# Altium project Project Board Module AM625.PrjPCB (part 1 of 2)
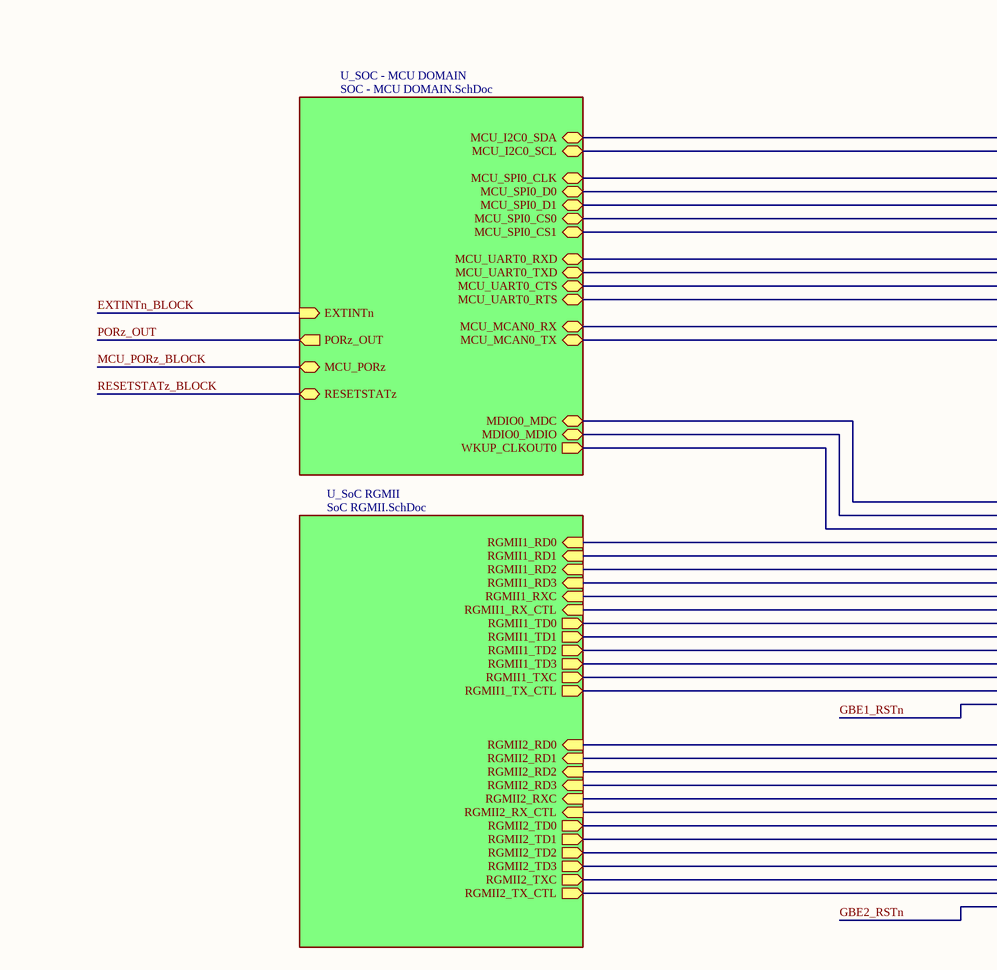
[diagram p0: BLOCK DIAGRAM.SchDoc, top left]
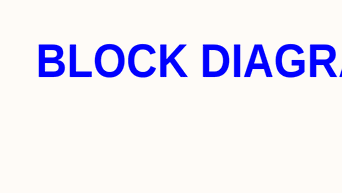
[diagram p1: BLOCK DIAGRAM.SchDoc, top right]
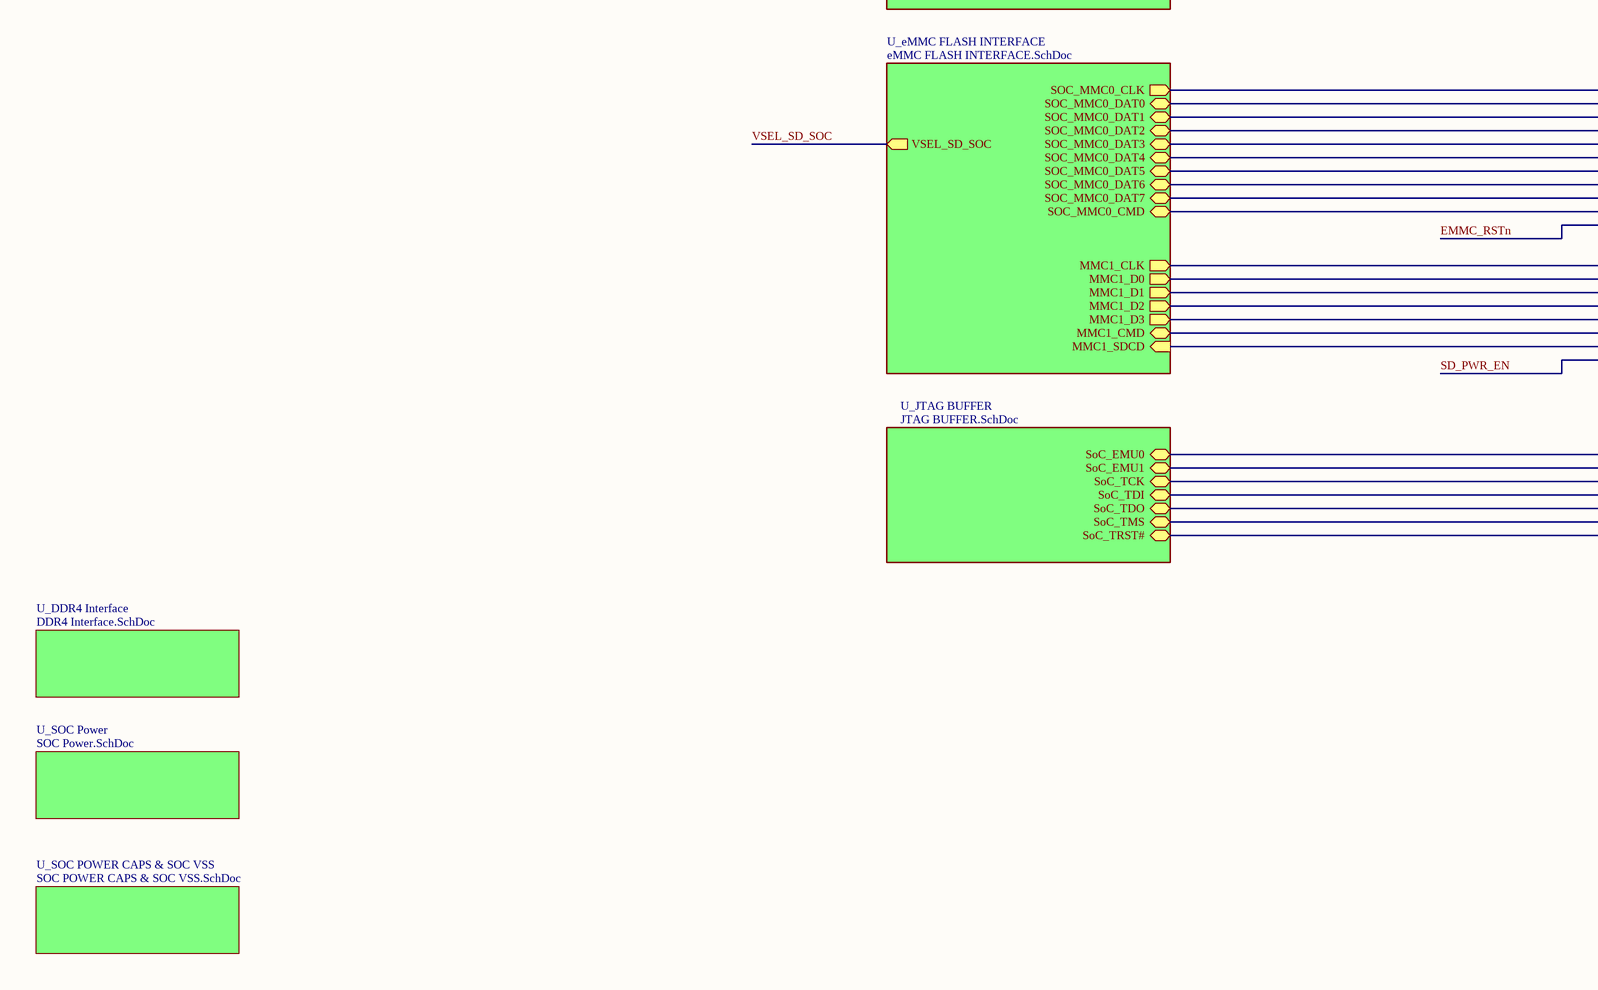
[diagram p2: BLOCK DIAGRAM.SchDoc, bottom left]
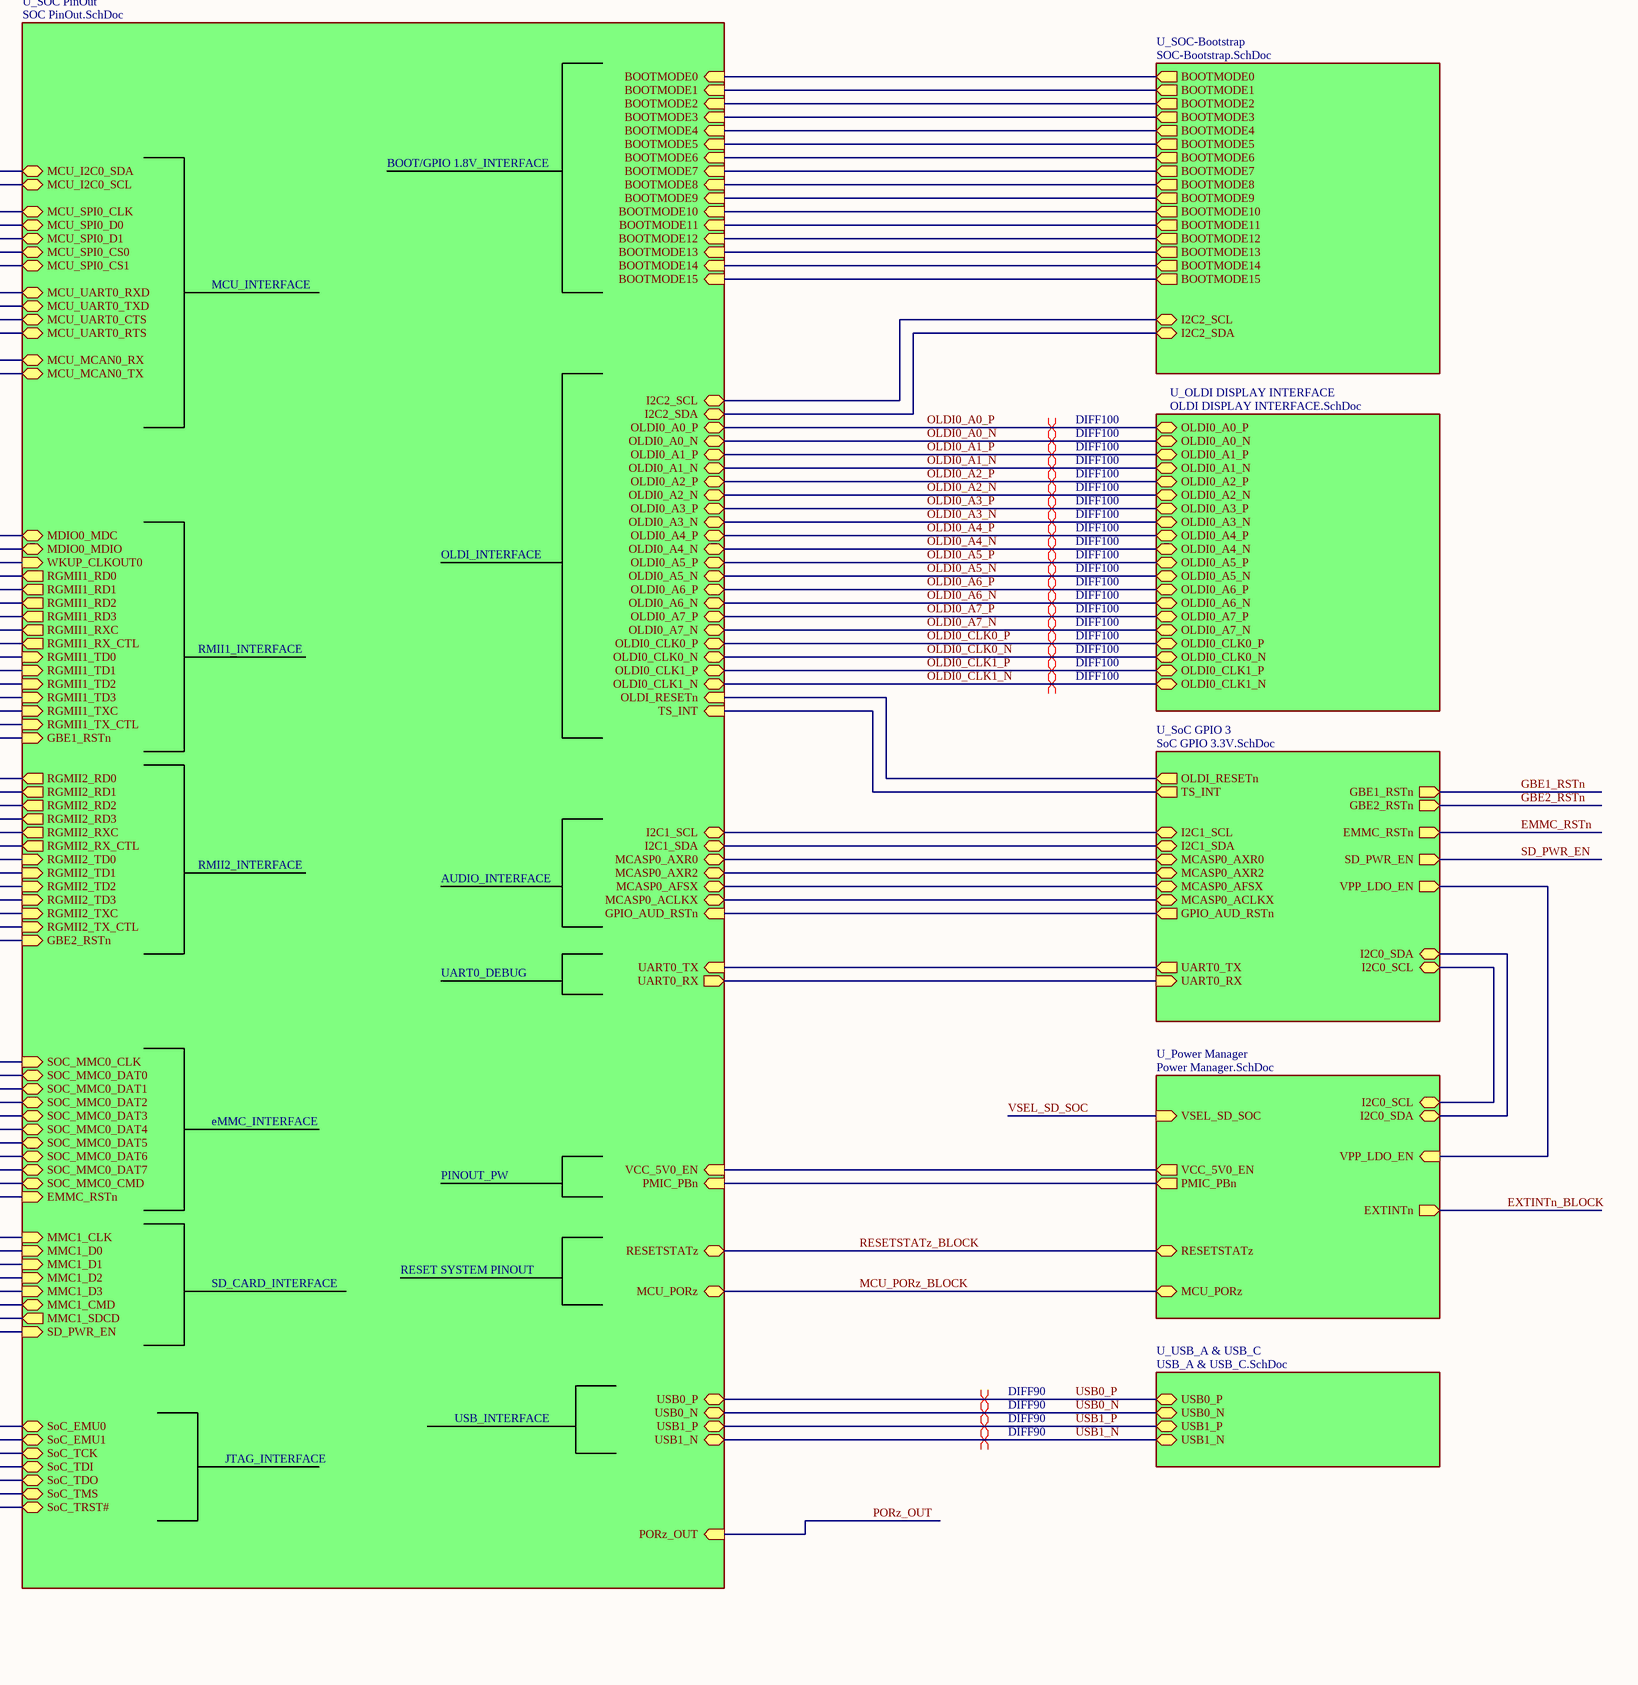
[diagram p3: BLOCK DIAGRAM.SchDoc, bottom right]
8 sheets, 155 parts. Net scope: flat (ports and power ports of the same name join across sheets).
Board file: PCB MODULE AM625.PcbDoc
Sheets:
  BLOCK DIAGRAM.SchDoc
    U_Power Manager = Power Manager.SchDoc
    U_SOC-Bootstrap = SOC-Bootstrap.SchDoc
    U_eMMC FLASH INTERFACE = eMMC FLASH INTERFACE.SchDoc
    U_DDR4 Interface = DDR4 Interface.SchDoc
    U_SOC POWER CAPS & SOC VSS = SOC POWER CAPS & SOC VSS.SchDoc
    U_SoC GPIO 3 = SoC GPIO 3.3V.SchDoc
    U_USB_A & USB_C = USB_A & USB_C.SchDoc

## Sheet BLOCK DIAGRAM.SchDoc
size A1; DocumentNumber: 14; SheetNumber: 1; SheetTotal: 14

### Sub-sheets
U_DDR4 Interface = DDR4 Interface.SchDoc: no entries
U_eMMC FLASH INTERFACE = eMMC FLASH INTERFACE.SchDoc: SOC_MMC0_CLK (out), SOC_MMC0_DAT0 (bidir), SOC_MMC0_DAT1 (bidir), SOC_MMC0_DAT2 (bidir), SOC_MMC0_DAT3 (bidir), SOC_MMC0_DAT4 (bidir), SOC_MMC0_DAT5 (bidir), SOC_MMC0_DAT6 (bidir), SOC_MMC0_DAT7 (bidir), SOC_MMC0_CMD (bidir), VSEL_SD_SOC (out), MMC1_CMD (bidir), MMC1_D1 (out), MMC1_D0 (out), MMC1_SDCD (in), MMC1_D3 (out), MMC1_CLK (out), MMC1_D2 (out)
U_JTAG BUFFER = JTAG BUFFER.SchDoc (file not in this document): SoC_EMU0 (bidir), SoC_EMU1 (bidir), SoC_TCK (bidir), SoC_TDI (bidir), SoC_TDO (bidir), SoC_TMS (bidir), SoC_TRST# (bidir)
U_OLDI DISPLAY INTERFACE = OLDI DISPLAY INTERFACE.SchDoc (file not in this document): OLDI0_A0_P (bidir), OLDI0_A0_N (bidir), OLDI0_A1_P (bidir), OLDI0_A1_N (bidir), OLDI0_A2_P (bidir), OLDI0_A2_N (bidir), OLDI0_A3_P (bidir), OLDI0_A3_N (bidir), OLDI0_A4_P (bidir), OLDI0_A4_N (bidir), OLDI0_A5_P (bidir), OLDI0_A5_N (bidir), OLDI0_A6_P (bidir), OLDI0_A6_N (bidir), OLDI0_A7_P (bidir), OLDI0_A7_N (bidir), OLDI0_CLK0_P (bidir), OLDI0_CLK0_N (bidir), OLDI0_CLK1_P (bidir), OLDI0_CLK1_N (bidir)
U_Power Manager = Power Manager.SchDoc: VCC_5V0_EN (out), VSEL_SD_SOC (in), RESETSTATz (bidir), VPP_LDO_EN (in), MCU_PORz (bidir), EXTINTn (out), I2C0_SDA (bidir), I2C0_SCL (bidir), PMIC_PBn (out)
U_SOC - MCU DOMAIN = SOC - MCU DOMAIN.SchDoc (file not in this document): MDIO0_MDC (bidir), MDIO0_MDIO (bidir), WKUP_CLKOUT0 (out), MCU_I2C0_SCL (bidir), MCU_I2C0_SDA (bidir), MCU_SPI0_CLK (bidir), MCU_SPI0_D0 (bidir), MCU_SPI0_D1 (bidir), MCU_SPI0_CS0 (bidir), MCU_SPI0_CS1 (bidir), MCU_UART0_RXD (bidir), MCU_UART0_TXD (bidir), MCU_UART0_CTS (bidir), MCU_UART0_RTS (bidir), MCU_MCAN0_RX (bidir), MCU_MCAN0_TX (bidir), MCU_PORz (bidir), EXTINTn (in), PORz_OUT (out), RESETSTATz (bidir)
U_SoC GPIO 3 = SoC GPIO 3.3V.SchDoc: OLDI_RESETn (out), I2C0_SDA (bidir), I2C0_SCL (bidir), I2C1_SDA (bidir), I2C1_SCL (bidir), EMMC_RSTn (out), VPP_LDO_EN (out), MCASP0_ACLKX (bidir), MCASP0_AXR2 (bidir), MCASP0_AXR0 (bidir), MCASP0_AFSX (bidir), GPIO_AUD_RSTn (out), TS_INT (out), UART0_RX (in), UART0_TX (out), SD_PWR_EN (out), GBE2_RSTn (out), GBE1_RSTn (out)
U_SOC PinOut = SOC PinOut.SchDoc (file not in this document): VCC_5V0_EN (in), SOC_MMC0_CLK (in), SOC_MMC0_DAT0 (bidir), SOC_MMC0_DAT1 (bidir), SOC_MMC0_DAT2 (bidir), SOC_MMC0_DAT3 (bidir), SOC_MMC0_DAT4 (bidir), SOC_MMC0_DAT5 (bidir), SOC_MMC0_DAT6 (bidir), SOC_MMC0_DAT7 (bidir), SOC_MMC0_CMD (bidir), EMMC_RSTn (in), SoC_EMU0 (bidir), SoC_EMU1 (bidir), SoC_TCK (bidir), SoC_TDO (bidir), SoC_TRST# (bidir), MCU_I2C0_SCL (bidir), MCU_I2C0_SDA (bidir), MCU_SPI0_CLK (bidir), MCU_SPI0_D0 (bidir), MCU_SPI0_D1 (bidir), MCU_SPI0_CS0 (bidir), MCU_SPI0_CS1 (bidir), MCU_UART0_RXD (bidir), MCU_UART0_TXD (bidir), MCU_UART0_CTS (bidir), MCU_UART0_RTS (bidir), MCU_MCAN0_RX (bidir), MCU_MCAN0_TX (bidir), OLDI0_A0_P (bidir), OLDI0_A0_N (bidir), OLDI0_A1_P (bidir), OLDI0_A1_N (bidir), OLDI0_A2_P (bidir), OLDI0_A2_N (bidir), OLDI0_A3_P (bidir), OLDI0_A3_N (bidir), OLDI0_A4_P (bidir), OLDI0_A4_N (bidir), OLDI0_A5_P (bidir), OLDI0_A5_N (bidir), OLDI0_A6_P (bidir), OLDI0_A6_N (bidir), OLDI0_A7_P (bidir), OLDI0_A7_N (bidir), OLDI0_CLK0_P (bidir), OLDI0_CLK0_N (bidir), OLDI0_CLK1_P (bidir), OLDI0_CLK1_N (bidir), I2C2_SCL (bidir), I2C2_SDA (bidir), RGMII1_RD0 (out), RGMII1_RD1 (out), RGMII1_RD2 (out), RGMII1_RD3 (out), RGMII1_RXC (out), RGMII1_RX_CTL (out), RGMII1_TD0 (in), RGMII1_TXC (in), RGMII1_TX_CTL (in), RGMII1_TD1 (in), RGMII1_TD2 (in), RGMII1_TD3 (in), MDIO0_MDC (bidir), MDIO0_MDIO (bidir), WKUP_CLKOUT0 (in), BOOTMODE0 (in), BOOTMODE1 (in), BOOTMODE2 (in), BOOTMODE3 (in), BOOTMODE4 (in), BOOTMODE5 (in), BOOTMODE6 (in), BOOTMODE7 (in), BOOTMODE8 (in), BOOTMODE9 (in), BOOTMODE10 (in), BOOTMODE11 (in), BOOTMODE12 (in), BOOTMODE13 (in), BOOTMODE14 (in), BOOTMODE15 (in), PORz_OUT (in), RESETSTATz (bidir), USB0_P (bidir), USB0_N (bidir), I2C1_SDA (bidir), I2C1_SCL (bidir), MCASP0_ACLKX (bidir), MCASP0_AXR2 (bidir), MCASP0_AXR0 (bidir), MCASP0_AFSX (bidir), GPIO_AUD_RSTn (in), USB1_P (bidir), USB1_N (bidir), OLDI_RESETn (in), TS_INT (in), UART0_RX (out), UART0_TX (in), RGMII2_TD0 (in), MMC1_CLK (in), RGMII2_RD3 (out), MMC1_D3 (in), MMC1_CMD (bidir), RGMII2_RD0 (out), MMC1_D1 (in), RGMII2_RX_CTL (out), RGMII2_TXC (in), SD_PWR_EN (in), MMC1_D2 (in), MMC1_SDCD (out), RGMII2_RXC (out), RGMII2_RD2 (out), GBE2_RSTn (in), RGMII2_TD2 (in), RGMII2_TD1 (in), RGMII2_TX_CTL (in), MCU_PORz (bidir), RGMII2_TD3 (in), MMC1_D0 (in), RGMII2_RD1 (out), GBE1_RSTn (in), SoC_TDI (bidir), SoC_TMS (bidir), PMIC_PBn (in)
U_SOC Power = SOC Power.SchDoc (file not in this document): no entries
U_SOC POWER CAPS & SOC VSS = SOC POWER CAPS & SOC VSS.SchDoc: no entries
U_SoC RGMII = SoC RGMII.SchDoc (file not in this document): RGMII1_RD0 (in), RGMII1_RD1 (in), RGMII1_RD2 (in), RGMII1_RD3 (in), RGMII1_RXC (in), RGMII1_RX_CTL (in), RGMII1_TD0 (out), RGMII1_TXC (out), RGMII1_TX_CTL (out), RGMII1_TD1 (out), RGMII1_TD2 (out), RGMII1_TD3 (out), RGMII2_RD1 (in), RGMII2_RD0 (in), RGMII2_RXC (in), RGMII2_RD2 (in), RGMII2_TX_CTL (out), RGMII2_TD2 (out), RGMII2_RX_CTL (in), RGMII2_TD1 (out), RGMII2_TD0 (out), RGMII2_TXC (out), RGMII2_TD3 (out), RGMII2_RD3 (in)
U_SOC-Bootstrap = SOC-Bootstrap.SchDoc: BOOTMODE0 (out), BOOTMODE1 (out), BOOTMODE2 (out), BOOTMODE3 (out), BOOTMODE4 (out), BOOTMODE5 (out), BOOTMODE6 (out), BOOTMODE7 (out), BOOTMODE8 (out), BOOTMODE9 (out), BOOTMODE10 (out), BOOTMODE11 (out), BOOTMODE12 (out), BOOTMODE13 (out), BOOTMODE14 (out), BOOTMODE15 (out), I2C2_SCL (bidir), I2C2_SDA (bidir)
U_USB_A & USB_C = USB_A & USB_C.SchDoc: USB0_P (bidir), USB0_N (bidir), USB1_P (bidir), USB1_N (bidir)

### Nets
EMMC_RSTn: sheet U_SOC PinOut/EMMC_RSTn, sheet U_SoC GPIO 3/EMMC_RSTn
EXTINTn_BLOCK: sheet U_Power Manager/EXTINTn, sheet U_SOC - MCU DOMAIN/EXTINTn
GBE1_RSTn: sheet U_SOC PinOut/GBE1_RSTn, sheet U_SoC GPIO 3/GBE1_RSTn
GBE2_RSTn: sheet U_SOC PinOut/GBE2_RSTn, sheet U_SoC GPIO 3/GBE2_RSTn
MCU_PORz_BLOCK: sheet U_Power Manager/MCU_PORz, sheet U_SOC - MCU DOMAIN/MCU_PORz, sheet U_SOC PinOut/MCU_PORz
OLDI0_A0_N: sheet U_SOC PinOut/OLDI0_A0_N, sheet U_OLDI DISPLAY INTERFACE/OLDI0_A0_N
OLDI0_A0_P: sheet U_SOC PinOut/OLDI0_A0_P, sheet U_OLDI DISPLAY INTERFACE/OLDI0_A0_P
OLDI0_A1_N: sheet U_SOC PinOut/OLDI0_A1_N, sheet U_OLDI DISPLAY INTERFACE/OLDI0_A1_N
OLDI0_A1_P: sheet U_SOC PinOut/OLDI0_A1_P, sheet U_OLDI DISPLAY INTERFACE/OLDI0_A1_P
OLDI0_A2_N: sheet U_SOC PinOut/OLDI0_A2_N, sheet U_OLDI DISPLAY INTERFACE/OLDI0_A2_N
OLDI0_A2_P: sheet U_SOC PinOut/OLDI0_A2_P, sheet U_OLDI DISPLAY INTERFACE/OLDI0_A2_P
OLDI0_A3_N: sheet U_SOC PinOut/OLDI0_A3_N, sheet U_OLDI DISPLAY INTERFACE/OLDI0_A3_N
OLDI0_A3_P: sheet U_SOC PinOut/OLDI0_A3_P, sheet U_OLDI DISPLAY INTERFACE/OLDI0_A3_P
OLDI0_A4_N: sheet U_SOC PinOut/OLDI0_A4_N, sheet U_OLDI DISPLAY INTERFACE/OLDI0_A4_N
OLDI0_A4_P: sheet U_SOC PinOut/OLDI0_A4_P, sheet U_OLDI DISPLAY INTERFACE/OLDI0_A4_P
OLDI0_A5_N: sheet U_SOC PinOut/OLDI0_A5_N, sheet U_OLDI DISPLAY INTERFACE/OLDI0_A5_N
OLDI0_A5_P: sheet U_SOC PinOut/OLDI0_A5_P, sheet U_OLDI DISPLAY INTERFACE/OLDI0_A5_P
OLDI0_A6_N: sheet U_SOC PinOut/OLDI0_A6_N, sheet U_OLDI DISPLAY INTERFACE/OLDI0_A6_N
OLDI0_A6_P: sheet U_SOC PinOut/OLDI0_A6_P, sheet U_OLDI DISPLAY INTERFACE/OLDI0_A6_P
OLDI0_A7_N: sheet U_SOC PinOut/OLDI0_A7_N, sheet U_OLDI DISPLAY INTERFACE/OLDI0_A7_N
OLDI0_A7_P: sheet U_SOC PinOut/OLDI0_A7_P, sheet U_OLDI DISPLAY INTERFACE/OLDI0_A7_P
OLDI0_CLK0_N: sheet U_SOC PinOut/OLDI0_CLK0_N, sheet U_OLDI DISPLAY INTERFACE/OLDI0_CLK0_N
OLDI0_CLK0_P: sheet U_SOC PinOut/OLDI0_CLK0_P, sheet U_OLDI DISPLAY INTERFACE/OLDI0_CLK0_P
OLDI0_CLK1_N: sheet U_SOC PinOut/OLDI0_CLK1_N, sheet U_OLDI DISPLAY INTERFACE/OLDI0_CLK1_N
OLDI0_CLK1_P: sheet U_SOC PinOut/OLDI0_CLK1_P, sheet U_OLDI DISPLAY INTERFACE/OLDI0_CLK1_P
PORz_OUT: sheet U_SOC - MCU DOMAIN/PORz_OUT, sheet U_SOC PinOut/PORz_OUT
RESETSTATz_BLOCK: sheet U_Power Manager/RESETSTATz, sheet U_SOC - MCU DOMAIN/RESETSTATz, sheet U_SOC PinOut/RESETSTATz
SD_PWR_EN: sheet U_SOC PinOut/SD_PWR_EN, sheet U_SoC GPIO 3/SD_PWR_EN
USB0_N: sheet U_SOC PinOut/USB0_N, sheet U_USB_A & USB_C/USB0_N
USB0_P: sheet U_SOC PinOut/USB0_P, sheet U_USB_A & USB_C/USB0_P
USB1_N: sheet U_SOC PinOut/USB1_N, sheet U_USB_A & USB_C/USB1_N
USB1_P: sheet U_SOC PinOut/USB1_P, sheet U_USB_A & USB_C/USB1_P
VSEL_SD_SOC: sheet U_Power Manager/VSEL_SD_SOC, sheet U_eMMC FLASH INTERFACE/VSEL_SD_SOC
(unnamed): sheet U_Power Manager/VCC_5V0_EN, sheet U_SOC PinOut/VCC_5V0_EN
(unnamed): sheet U_Power Manager/VPP_LDO_EN, sheet U_SoC GPIO 3/VPP_LDO_EN
(unnamed): sheet U_Power Manager/I2C0_SDA, sheet U_SoC GPIO 3/I2C0_SDA
(unnamed): sheet U_Power Manager/I2C0_SCL, sheet U_SoC GPIO 3/I2C0_SCL
(unnamed): sheet U_Power Manager/PMIC_PBn, sheet U_SOC PinOut/PMIC_PBn
(unnamed): sheet U_SOC - MCU DOMAIN/MDIO0_MDC, sheet U_SOC PinOut/MDIO0_MDC
(unnamed): sheet U_SOC - MCU DOMAIN/MDIO0_MDIO, sheet U_SOC PinOut/MDIO0_MDIO
(unnamed): sheet U_SOC - MCU DOMAIN/WKUP_CLKOUT0, sheet U_SOC PinOut/WKUP_CLKOUT0
(unnamed): sheet U_SOC - MCU DOMAIN/MCU_I2C0_SCL, sheet U_SOC PinOut/MCU_I2C0_SCL
(unnamed): sheet U_SOC - MCU DOMAIN/MCU_I2C0_SDA, sheet U_SOC PinOut/MCU_I2C0_SDA
(unnamed): sheet U_SOC - MCU DOMAIN/MCU_SPI0_CLK, sheet U_SOC PinOut/MCU_SPI0_CLK
(unnamed): sheet U_SOC - MCU DOMAIN/MCU_SPI0_D0, sheet U_SOC PinOut/MCU_SPI0_D0
(unnamed): sheet U_SOC - MCU DOMAIN/MCU_SPI0_D1, sheet U_SOC PinOut/MCU_SPI0_D1
(unnamed): sheet U_SOC - MCU DOMAIN/MCU_SPI0_CS0, sheet U_SOC PinOut/MCU_SPI0_CS0
(unnamed): sheet U_SOC - MCU DOMAIN/MCU_SPI0_CS1, sheet U_SOC PinOut/MCU_SPI0_CS1
(unnamed): sheet U_SOC - MCU DOMAIN/MCU_UART0_RXD, sheet U_SOC PinOut/MCU_UART0_RXD
(unnamed): sheet U_SOC - MCU DOMAIN/MCU_UART0_TXD, sheet U_SOC PinOut/MCU_UART0_TXD
(unnamed): sheet U_SOC - MCU DOMAIN/MCU_UART0_CTS, sheet U_SOC PinOut/MCU_UART0_CTS
(unnamed): sheet U_SOC - MCU DOMAIN/MCU_UART0_RTS, sheet U_SOC PinOut/MCU_UART0_RTS
(unnamed): sheet U_SOC - MCU DOMAIN/MCU_MCAN0_RX, sheet U_SOC PinOut/MCU_MCAN0_RX
(unnamed): sheet U_SOC - MCU DOMAIN/MCU_MCAN0_TX, sheet U_SOC PinOut/MCU_MCAN0_TX
(unnamed): sheet U_SOC PinOut/SOC_MMC0_CLK, sheet U_eMMC FLASH INTERFACE/SOC_MMC0_CLK
(unnamed): sheet U_SOC PinOut/SOC_MMC0_DAT0, sheet U_eMMC FLASH INTERFACE/SOC_MMC0_DAT0
(unnamed): sheet U_SOC PinOut/SOC_MMC0_DAT1, sheet U_eMMC FLASH INTERFACE/SOC_MMC0_DAT1
(unnamed): sheet U_SOC PinOut/SOC_MMC0_DAT2, sheet U_eMMC FLASH INTERFACE/SOC_MMC0_DAT2
(unnamed): sheet U_SOC PinOut/SOC_MMC0_DAT3, sheet U_eMMC FLASH INTERFACE/SOC_MMC0_DAT3
(unnamed): sheet U_SOC PinOut/SOC_MMC0_DAT4, sheet U_eMMC FLASH INTERFACE/SOC_MMC0_DAT4
(unnamed): sheet U_SOC PinOut/SOC_MMC0_DAT5, sheet U_eMMC FLASH INTERFACE/SOC_MMC0_DAT5
(unnamed): sheet U_SOC PinOut/SOC_MMC0_DAT6, sheet U_eMMC FLASH INTERFACE/SOC_MMC0_DAT6
(unnamed): sheet U_SOC PinOut/SOC_MMC0_DAT7, sheet U_eMMC FLASH INTERFACE/SOC_MMC0_DAT7
(unnamed): sheet U_SOC PinOut/SOC_MMC0_CMD, sheet U_eMMC FLASH INTERFACE/SOC_MMC0_CMD
(unnamed): sheet U_SOC PinOut/SoC_EMU0, sheet U_JTAG BUFFER/SoC_EMU0
(unnamed): sheet U_SOC PinOut/SoC_EMU1, sheet U_JTAG BUFFER/SoC_EMU1
(unnamed): sheet U_SOC PinOut/SoC_TCK, sheet U_JTAG BUFFER/SoC_TCK
(unnamed): sheet U_SOC PinOut/SoC_TDO, sheet U_JTAG BUFFER/SoC_TDO
(unnamed): sheet U_SOC PinOut/SoC_TRST#, sheet U_JTAG BUFFER/SoC_TRST#
(unnamed): sheet U_SOC PinOut/I2C2_SCL, sheet U_SOC-Bootstrap/I2C2_SCL
(unnamed): sheet U_SOC PinOut/I2C2_SDA, sheet U_SOC-Bootstrap/I2C2_SDA
(unnamed): sheet U_SOC PinOut/RGMII1_RD0, sheet U_SoC RGMII/RGMII1_RD0
(unnamed): sheet U_SOC PinOut/RGMII1_RD1, sheet U_SoC RGMII/RGMII1_RD1
(unnamed): sheet U_SOC PinOut/RGMII1_RD2, sheet U_SoC RGMII/RGMII1_RD2
(unnamed): sheet U_SOC PinOut/RGMII1_RD3, sheet U_SoC RGMII/RGMII1_RD3
(unnamed): sheet U_SOC PinOut/RGMII1_RXC, sheet U_SoC RGMII/RGMII1_RXC
(unnamed): sheet U_SOC PinOut/RGMII1_RX_CTL, sheet U_SoC RGMII/RGMII1_RX_CTL
(unnamed): sheet U_SOC PinOut/RGMII1_TD0, sheet U_SoC RGMII/RGMII1_TD0
(unnamed): sheet U_SOC PinOut/RGMII1_TXC, sheet U_SoC RGMII/RGMII1_TXC
(unnamed): sheet U_SOC PinOut/RGMII1_TX_CTL, sheet U_SoC RGMII/RGMII1_TX_CTL
(unnamed): sheet U_SOC PinOut/RGMII1_TD1, sheet U_SoC RGMII/RGMII1_TD1
(unnamed): sheet U_SOC PinOut/RGMII1_TD2, sheet U_SoC RGMII/RGMII1_TD2
(unnamed): sheet U_SOC PinOut/RGMII1_TD3, sheet U_SoC RGMII/RGMII1_TD3
(unnamed): sheet U_SOC PinOut/BOOTMODE0, sheet U_SOC-Bootstrap/BOOTMODE0
(unnamed): sheet U_SOC PinOut/BOOTMODE1, sheet U_SOC-Bootstrap/BOOTMODE1
(unnamed): sheet U_SOC PinOut/BOOTMODE2, sheet U_SOC-Bootstrap/BOOTMODE2
(unnamed): sheet U_SOC PinOut/BOOTMODE3, sheet U_SOC-Bootstrap/BOOTMODE3
(unnamed): sheet U_SOC PinOut/BOOTMODE4, sheet U_SOC-Bootstrap/BOOTMODE4
(unnamed): sheet U_SOC PinOut/BOOTMODE5, sheet U_SOC-Bootstrap/BOOTMODE5
(unnamed): sheet U_SOC PinOut/BOOTMODE6, sheet U_SOC-Bootstrap/BOOTMODE6
(unnamed): sheet U_SOC PinOut/BOOTMODE7, sheet U_SOC-Bootstrap/BOOTMODE7
(unnamed): sheet U_SOC PinOut/BOOTMODE8, sheet U_SOC-Bootstrap/BOOTMODE8
(unnamed): sheet U_SOC PinOut/BOOTMODE9, sheet U_SOC-Bootstrap/BOOTMODE9
(unnamed): sheet U_SOC PinOut/BOOTMODE10, sheet U_SOC-Bootstrap/BOOTMODE10
(unnamed): sheet U_SOC PinOut/BOOTMODE11, sheet U_SOC-Bootstrap/BOOTMODE11
(unnamed): sheet U_SOC PinOut/BOOTMODE12, sheet U_SOC-Bootstrap/BOOTMODE12
(unnamed): sheet U_SOC PinOut/BOOTMODE13, sheet U_SOC-Bootstrap/BOOTMODE13
(unnamed): sheet U_SOC PinOut/BOOTMODE14, sheet U_SOC-Bootstrap/BOOTMODE14
(unnamed): sheet U_SOC PinOut/BOOTMODE15, sheet U_SOC-Bootstrap/BOOTMODE15
(unnamed): sheet U_SOC PinOut/I2C1_SDA, sheet U_SoC GPIO 3/I2C1_SDA
(unnamed): sheet U_SOC PinOut/I2C1_SCL, sheet U_SoC GPIO 3/I2C1_SCL
(unnamed): sheet U_SOC PinOut/MCASP0_ACLKX, sheet U_SoC GPIO 3/MCASP0_ACLKX
(unnamed): sheet U_SOC PinOut/MCASP0_AXR2, sheet U_SoC GPIO 3/MCASP0_AXR2
(unnamed): sheet U_SOC PinOut/MCASP0_AXR0, sheet U_SoC GPIO 3/MCASP0_AXR0
(unnamed): sheet U_SOC PinOut/MCASP0_AFSX, sheet U_SoC GPIO 3/MCASP0_AFSX
(unnamed): sheet U_SOC PinOut/GPIO_AUD_RSTn, sheet U_SoC GPIO 3/GPIO_AUD_RSTn
(unnamed): sheet U_SOC PinOut/OLDI_RESETn, sheet U_SoC GPIO 3/OLDI_RESETn
(unnamed): sheet U_SOC PinOut/TS_INT, sheet U_SoC GPIO 3/TS_INT
(unnamed): sheet U_SOC PinOut/UART0_RX, sheet U_SoC GPIO 3/UART0_RX
(unnamed): sheet U_SOC PinOut/UART0_TX, sheet U_SoC GPIO 3/UART0_TX
(unnamed): sheet U_SOC PinOut/RGMII2_TD0, sheet U_SoC RGMII/RGMII2_TD0
(unnamed): sheet U_SOC PinOut/MMC1_CLK, sheet U_eMMC FLASH INTERFACE/MMC1_CLK
(unnamed): sheet U_SOC PinOut/RGMII2_RD3, sheet U_SoC RGMII/RGMII2_RD3
(unnamed): sheet U_SOC PinOut/MMC1_D3, sheet U_eMMC FLASH INTERFACE/MMC1_D3
(unnamed): sheet U_SOC PinOut/MMC1_CMD, sheet U_eMMC FLASH INTERFACE/MMC1_CMD
(unnamed): sheet U_SOC PinOut/RGMII2_RD0, sheet U_SoC RGMII/RGMII2_RD0
(unnamed): sheet U_SOC PinOut/MMC1_D1, sheet U_eMMC FLASH INTERFACE/MMC1_D1
(unnamed): sheet U_SOC PinOut/RGMII2_RX_CTL, sheet U_SoC RGMII/RGMII2_RX_CTL
(unnamed): sheet U_SOC PinOut/RGMII2_TXC, sheet U_SoC RGMII/RGMII2_TXC
(unnamed): sheet U_SOC PinOut/MMC1_D2, sheet U_eMMC FLASH INTERFACE/MMC1_D2
(unnamed): sheet U_SOC PinOut/MMC1_SDCD, sheet U_eMMC FLASH INTERFACE/MMC1_SDCD
(unnamed): sheet U_SOC PinOut/RGMII2_RXC, sheet U_SoC RGMII/RGMII2_RXC
(unnamed): sheet U_SOC PinOut/RGMII2_RD2, sheet U_SoC RGMII/RGMII2_RD2
(unnamed): sheet U_SOC PinOut/RGMII2_TD2, sheet U_SoC RGMII/RGMII2_TD2
(unnamed): sheet U_SOC PinOut/RGMII2_TD1, sheet U_SoC RGMII/RGMII2_TD1
(unnamed): sheet U_SOC PinOut/RGMII2_TX_CTL, sheet U_SoC RGMII/RGMII2_TX_CTL
(unnamed): sheet U_SOC PinOut/RGMII2_TD3, sheet U_SoC RGMII/RGMII2_TD3
(unnamed): sheet U_SOC PinOut/MMC1_D0, sheet U_eMMC FLASH INTERFACE/MMC1_D0
(unnamed): sheet U_SOC PinOut/RGMII2_RD1, sheet U_SoC RGMII/RGMII2_RD1
(unnamed): sheet U_SOC PinOut/SoC_TDI, sheet U_JTAG BUFFER/SoC_TDI
(unnamed): sheet U_SOC PinOut/SoC_TMS, sheet U_JTAG BUFFER/SoC_TMS

### Layout directives
differential pair; net class DIFF100: OLDI0_A0_N, OLDI0_A0_P, OLDI0_A1_N, OLDI0_A1_P, OLDI0_A2_N, OLDI0_A2_P, OLDI0_A3_N, OLDI0_A3_P, OLDI0_A4_N, OLDI0_A4_P, OLDI0_A5_N, OLDI0_A5_P, OLDI0_A6_N, OLDI0_A6_P, OLDI0_A7_N, OLDI0_A7_P, OLDI0_CLK0_N, OLDI0_CLK0_P, OLDI0_CLK1_N, OLDI0_CLK1_P
differential pair; net class DIFF90: USB0_N, USB0_P, USB1_N, USB1_P

### Notes on the sheet
- BLOCK DIAGRAM PIN OUT INTERFACE
- BOOT/GPIO 1.8V_INTERFACE
- MCU_INTERFACE
- OLDI_INTERFACE
- RMII1_INTERFACE
- RMII2_INTERFACE
- AUDIO_INTERFACE
- UART0_DEBUG
- eMMC_INTERFACE
- PINOUT_PW
- SD_CARD_INTERFACE
- RESET SYSTEM PINOUT
- USB_INTERFACE
- JTAG_INTERFACE

## Sheet Power Manager.SchDoc
size A2; DocumentNumber: 1; SheetNumber: 2; SheetTotal: 14
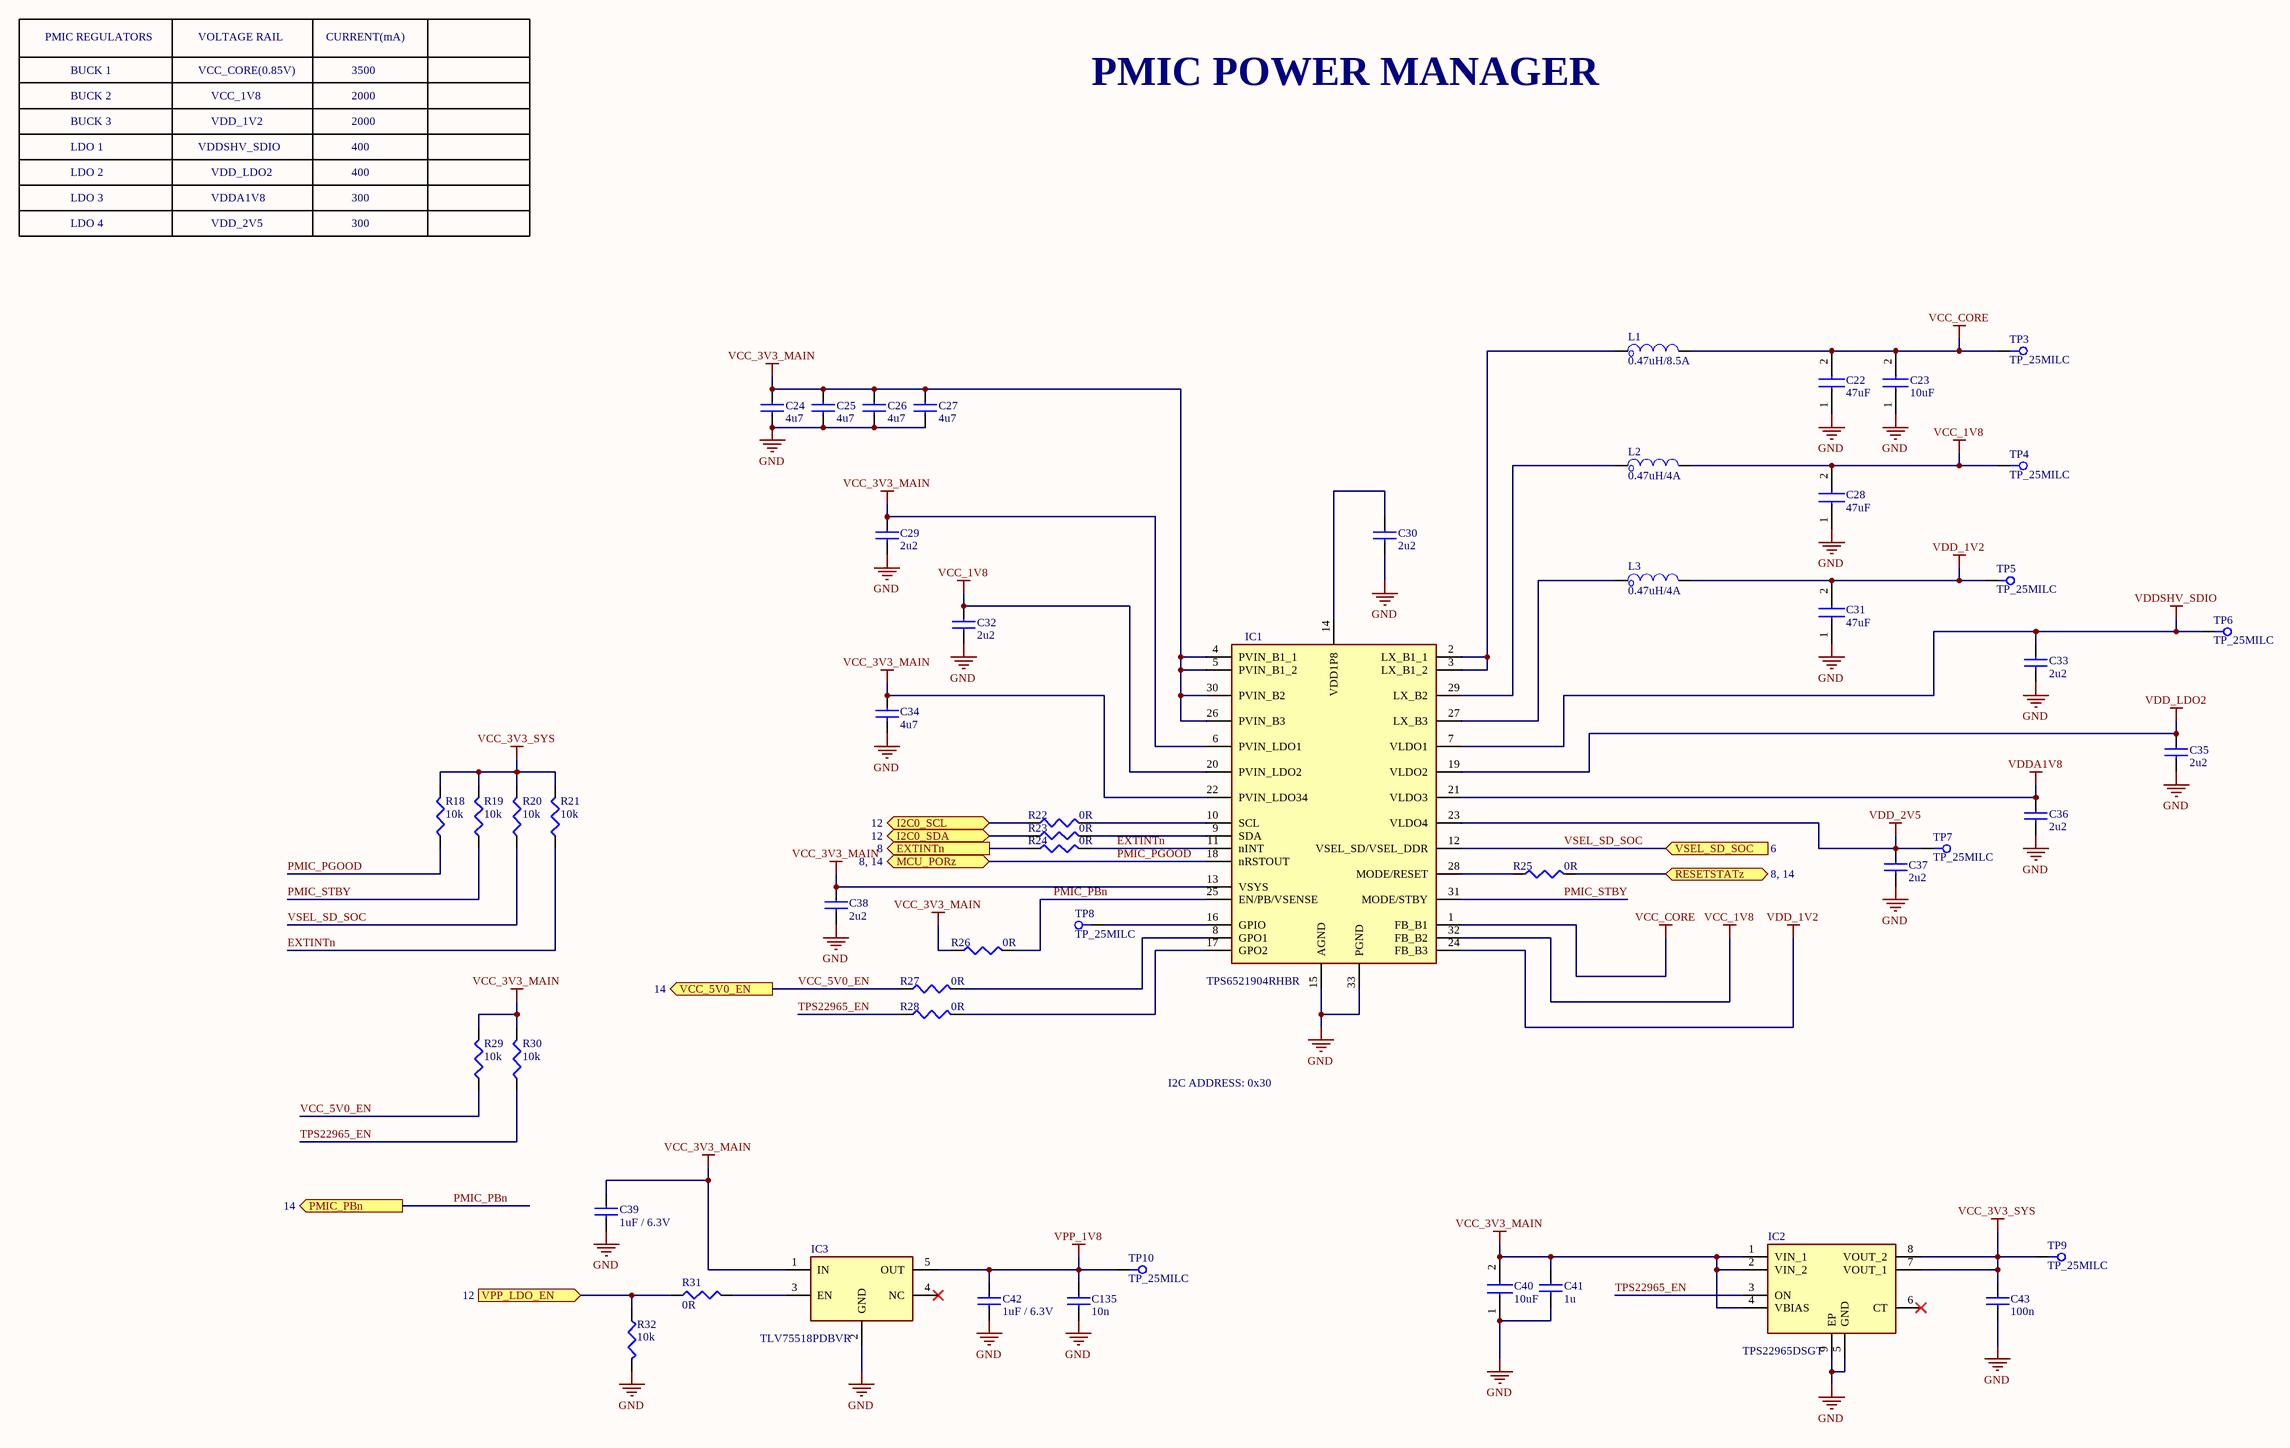
[diagram p4: Power Manager.SchDoc]

### Parts
C22  47uF  [C0805]
C23  10uF  [C0603]
C24  4u7  [C0402]
C25  4u7  [C0402]
C26  4u7  [C0402]
C27  4u7  [C0402]
C28  47uF  [C0805]
C29  2u2  [C0402]
C30  2u2  [C0402]
C31  47uF  [C0805]
C32  2u2  [C0402]
C33  2u2  [C0402]
C34  4u7  [C0402]
C35  2u2  [C0402]
C36  2u2  [C0402]
C37  2u2  [C0402]
C38  2u2  [C0402]
C39  1uF / 6.3V  [C0201]
C40  10uF  [C0603]
C41  1u  [C0402]
C42  1uF / 6.3V  [C0201]
C43  100n  [C0402]
C135  10n  [C0201]
IC1  TPS6521904RHBR  [32-VQFN (5x5)]
IC2  TPS22965DSGT  [SON50P200X200X80-9N]
IC3  TLV75518PDBVR  [SOT95P280X145-5N]
L1  0.47uH/8.5A  [INDC3225X20N]
L2  0.47uH/4A  [FP-TFM201208BLE-R47MTCF_0805-MFG]
L3  0.47uH/4A  [FP-TFM201208BLE-R47MTCF_0805-MFG]
R18  10k  [R0402]
R19  10k  [R0402]
R20  10k  [R0402]
R21  10k  [R0402]
R22  0R  [R0201]
R23  0R  [R0201]
R24  0R  [R0201]
R25  0R  [R0201]
R26  0R  [R0402]
R27  0R  [R0402]
R28  0R  [R0402]
R29  10k  [R0402]
R30  10k  [R0402]
R31  0R  [R0201]
R32  10k  [R0201]
TP3  TP_25MILC  [TP_25C]  (no BOM)
TP4  TP_25MILC  [TP_25C]  (no BOM)
TP5  TP_25MILC  [TP_25C]  (no BOM)
TP6  TP_25MILC  [TP_25C]  (no BOM)
TP7  TP_25MILC  [TP_25C]  (no BOM)
TP8  TP_25MILC  [TP_25C]  (no BOM)
TP9  TP_25MILC  [TP_25C]  (no BOM)
TP10  TP_25MILC  [TP_25C]  (no BOM)

### Ports
EXTINTn (out, see 8), I2C0_SCL (bidir, see 12), I2C0_SDA (bidir, see 12), MCU_PORz (bidir, see 8, 14), PMIC_PBn (out, see 14), RESETSTATz (bidir, see 8, 14), VCC_5V0_EN (out, see 14), VPP_LDO_EN (in, see 12), VSEL_SD_SOC (in, see 6)

### Nets
GND: C22.1 C23.1 C24.2 C25.2 C26.2 C27.2 C28.1 C29.2 C30.2 C31.1 C32.2 C33.2 C34.2 C35.2 C36.2 C37.2 C38.2 C39.2 C40.1 C41.2 C42.2 C43.2 C135.2 IC1.15(AGND) IC1.33(PGND) IC2.5(GND) IC2.9(EP) IC3.2(GND) R32.2
VCC_1V8: C28.2 C32.1 IC1.20(PVIN_LDO2) IC1.32(FB_B2) L2.2 TP4.1
VCC_3V3_MAIN: C24.1 C25.1 C26.1 C27.1 C29.1 C34.1 C38.1 C39.1 C40.2 C41.1 IC1.4(PVIN_B1_1) IC1.5(PVIN_B1_2) IC1.6(PVIN_LDO1) IC1.13(VSYS) IC1.22(PVIN_LDO34) IC1.26(PVIN_B3) IC1.30(PVIN_B2) IC2.1(VIN_1) IC2.2(VIN_2) IC2.4(VBIAS) IC3.1(IN) R26.1 R29.2 R30.2
VCC_3V3_SYS: C43.1 IC2.7(VOUT_1) IC2.8(VOUT_2) R18.2 R19.2 R20.2 R21.2 TP9.1
VCC_CORE: C22.2 C23.2 IC1.1(FB_B1) L1.2 TP3.1
VDD_1V2: C31.2 IC1.24(FB_B3) L3.2 TP5.1
VDD_2V5: C37.1 IC1.23(VLDO4) TP7.1
VDD_LDO2: C35.1 IC1.19(VLDO2)
VDDA1V8: C36.1 IC1.21(VLDO3)
VDDSHV_SDIO: C33.1 IC1.7(VLDO1) TP6.1
VPP_1V8: C42.1 C135.1 IC3.5(OUT) TP10.1
EXTINTn: IC1.11(nINT) R21.1 R24.2
EXTINTn: R24.1 ; port EXTINTn  [a separate net that carries the same name]
I2C0_SCL: R22.1 ; port I2C0_SCL
I2C0_SDA: R23.1 ; port I2C0_SDA
PMIC_PBn: IC1.25(EN/PB/VSENSE) R26.2 ; port PMIC_PBn
PMIC_PGOOD: IC1.18(nRSTOUT) R18.1 ; port MCU_PORz
PMIC_STBY: IC1.31(MODE/STBY) R19.1
RESETSTATz: R25.2 ; port RESETSTATz
TPS22965_EN: IC2.3(ON) R28.1 R30.1
VCC_5V0_EN: R27.1 R29.1 ; port VCC_5V0_EN
VPP_LDO_EN: R31.1 R32.1 ; port VPP_LDO_EN
VSEL_SD_SOC: IC1.12(VSEL_SD/VSEL_DDR) R20.1 ; port VSEL_SD_SOC
NetC30_1: C30.1 IC1.14(VDD1P8)
NetIC1_2: IC1.2(LX_B1_1) IC1.3(LX_B1_2) L1.1
NetIC1_8: IC1.8(GPO1) R27.2
NetIC1_9: IC1.9(SDA) R23.2
NetIC1_10: IC1.10(SCL) R22.2
NetIC1_16: IC1.16(GPIO) TP8.1
NetIC1_17: IC1.17(GPO2) R28.2
NetIC1_27: IC1.27(LX_B3) L3.1
NetIC1_28: IC1.28(MODE/RESET) R25.1
NetIC1_29: IC1.29(LX_B2) L2.1
NetIC3_3: IC3.3(EN) R31.2

Not connected (* = marked no-connect by the designer): IC2 6(CT)*; IC3 4(NC)*

### Notes on the sheet
- PMIC REGULATORS
- VOLTAGE RAIL
- CURRENT(mA)
- BUCK 1
- BUCK 2
- BUCK 3
- VCC_CORE(0.85V)
- VCC_1V8
- VDD_1V2
- 3500
- 2000
- PMIC POWER MANAGER
- LDO 1
- LDO 2
- VDDSHV_SDIO
- VDD_LDO2
- 400
- LDO 3
- LDO 4
- VDDA1V8
- VDD_2V5
- 300
- I2C ADDRESS: 0x30

### Library data of the parts
C22 C28 C31 = CL21A476MQYNNNG: 47 µF ±20% 6.3V Ceramic Capacitor X5R 0805 (2012 Metric); Manufacturer_Name: SAMSUNG; Datasheet Link: https://www.arrow.com/en/products/cl21a476mqynnng/samsung-electro-mechanics; Height: 1.45mm; Manufacturer_Part_Number: CL21A476MQYNNNG; Mouser Part Number: 187-CL21A476MQYNNNG; Mouser Price/Stock: https://www.mouser.co.uk/ProductDetail/Samsung-Electro-Mechanics/CL21A476MQYNNNG?qs=yOVawPpwOwm7Wn%252B7DxvR5g%3D%3D; Arrow Part Number: CL21A476MQYNNNG; Arrow Price/Stock: https://www.arrow.com/en/products/cl21a476mqynnng/samsung-electro-mechanics; Supplier 1: Digi-Key; Manufacturer: Samsung; Manufacturer Part Number: CL21A476MQYNNNG; Stock 1: 609000; Pricing 1: 3000=0.0672, 6000=0.0622, 9000=0.0588, 15000=0.0558, 30000=0.0538, 75000=0.0504, 150000=0.0445 (USD); Mount: Surface Mount; Case/Package: 0805; Case Code (Metric): 2012; Case Code (Imperial): 0805; Material: Ceramic; Min Operating Temperature: -55°C; Max Operating Temperature: 85°C; Tolerance: 20%; Packaging: Tape and Reel; Package Quantity: 3000; Capacitance: 47uF; Voltage Rating: 6.3V; Dielectric: X5R; Voltage: 6.3V; Series: CL; Length: 2mm; Width: 0.049inch; Thickness: 0.057inch; Depth: 1.25mm; Radiation Hardening: No; RoHS Compliant: Yes; ComponentLink1URL: https://datasheet.ciiva.com/26838/getdatasheetpartid-687155-26838634.pdf?src-supplier=Verical; ComponentLink1Description: https://datasheet.ciiva.com/26838/getdatasheetpartid-687155-26838634.pdf?src-supplier=Verical; ComponentLink2URL: https://datasheet.ciiva.com/25723/cl21a476mqynnng-25723909.pdf?src-supplier=Digi-Key; ComponentLink2Description: https://datasheet.ciiva.com/25723/cl21a476mqynnng-25723909.pdf?src-supplier=Digi-Key; ComponentLink3URL: https://datasheet.ciiva.com/29199/454310-da-01-en-vs-kondensator-0805-29199769.pdf?src-supplier=Conrad; ComponentLink3Description: https://datasheet.ciiva.com/29199/454310-da-01-en-vs-kondensator-0805-29199769.pdf?src-supplier=Conrad; Supplier Part Number 1: 1276-6467-2-ND
C23 C40 = CL10A106MQ8NNNC: 10 µF ±20% 6.3V Ceramic Capacitor X5R 0603 (1608 Metric); Manufacturer_Name: SAMSUNG; Manufacturer Part Number: CL03A474KQ3NNNC; Capacitance: 470nF; Tolerance: 10%; Datasheet Link: http://uk.rs-online.com/web/p/products/7664718; Height: 0.9mm; Manufacturer_Part_Number: CL10A106MQ8NNNC; Mouser Part Number: 187-CL10A106MQ8NNNC; Mouser Price/Stock: https://www.mouser.co.uk/ProductDetail/Samsung-Electro-Mechanics/CL10A106MQ8NNNC?qs=349EhDEZ59qlB6a%2FjjeGAg%3D%3D; Arrow Part Number: CL10A106MQ8NNNC; Arrow Price/Stock: https://www.arrow.com/en/products/cl10a106mq8nnnc/samsung-electro-mechanics?region=nac; Manufacturer: Samsung; Mount: Surface Mount; Case/Package: 0201; Case Code (Metric): 0603; Case Code (Imperial): 0201; Min Operating Temperature: -55°C; Max Operating Temperature: 85°C; Package Quantity: 1; Packaging: Cut Tape; Voltage Rating: 6.3V; Series: CL; Voltage Rating (DC): 6.3V; Length: 0.024inch; Width: 0.012inch; Thickness: 0.013inch; RoHS Compliant: Yes; Lead Free: Lead Free; Supplier 1: Digi-Key; Stock 1: 2081153; Pricing 1: 1=0.11, 10=0.083, 50=0.0452, 100=0.0369, 500=0.0264, 1000=0.0207 (USD); Contact Plating: Tin; Dielectric: X5R; Voltage: 6.3V; Construction: Flat; Depth: 0.8mm; Radiation Hardening: No; ComponentLink1URL: https://datasheet.ciiva.com/25798/cl10a106mq8nnnc-25798320.pdf?src-supplier=Digi-Key; ComponentLink1Description: https://datasheet.ciiva.com/25798/cl10a106mq8nnnc-25798320.pdf?src-supplier=Digi-Key; ComponentLink2URL: https://datasheet.ciiva.com/26838/getdatasheetpartid-357557-26838347.pdf?src-supplier=Verical; ComponentLink2Description: https://datasheet.ciiva.com/26838/getdatasheetpartid-357557-26838347.pdf?src-supplier=Verical; ComponentLink3URL: https://datasheet.ciiva.com/16437/cl05b104kq5nnnc-16437327.pdf?src-supplier=Future+Electronics; ComponentLink3Description: https://datasheet.ciiva.com/16437/cl05b104kq5nnnc-16437327.pdf?src-supplier=Future+Electronics; Supplier Part Number 1: 1276-1119-6-ND
C24-C27 C34 = C1005X5R1A475M: CAP CER 4.7UF 10V 20% X5R 0402; Manufacturer: TDK Corporation; Capacitance: 4.7µF; .Checked PCB: used; Supplier 1: Digi-Key; Supplier Part Number 1: 445-8023-1-ND; Manufacturer Part Number: C1005X5R1A475M; RoHS: RoHS Compliant; Category: Capacitors; Stock 1: 10140; Pricing 1: 1=0.53, 10=0.415, 100=0.25, 250=0.18752, 500=0.16, 1000=0.125, 5000=0.095 (USD); Voltage - Rated: 10V; Tolerance: ±20%; Temperature Coefficient: X5R; Mounting Type: Surface Mount, MLCC; Operating Temperature: -55°C ~ 85°C; Applications: General Purpose; Ratings: -; Package / Case: 0402 (1005 Metric); Size / Dimension: 0.039" L x 0.020" W (1.00mm x 0.50mm); Height - Seated (Max): -; Thickness (Max): -; Lead Spacing: -; Features: -; Packaging: Cut Tape (CT); Lead Style: -; ComponentLink1URL: http://www.tdk.com/pdf/general_B11.pdf; ComponentLink1Description: http://www.tdk.com/pdf/general_B11.pdf; .Checked SCH: used
C29 C30 C32 C33 C35-C38 = C1005X5R1A225K: CAP CER 2.2UF 10V 10% X5R 0402; Manufacturer: TDK Corporation; Capacitance: 2.2µF; .Checked PCB: used; Supplier 1: Digi-Key; Supplier Part Number 1: 445-7392-1-ND; Manufacturer Part Number: C1005X5R1A225K; RoHS: RoHS Compliant; Category: Capacitors; Stock 1: 22891; Pricing 1: 1=0.42, 10=0.332, 100=0.2, 250=0.15, 500=0.128, 1000=0.1 (USD); Voltage - Rated: 10V; Tolerance: ±10%; Temperature Coefficient: X5R; Mounting Type: Surface Mount, MLCC; Operating Temperature: -55°C ~ 85°C; Applications: General Purpose; Ratings: -; Package / Case: 0402 (1005 Metric); Size / Dimension: 0.039" L x 0.020" W (1.00mm x 0.50mm); Height - Seated (Max): -; Thickness (Max): 0.022" (0.55mm); Lead Spacing: -; Features: -; Packaging: Cut Tape (CT); Lead Style: -; ComponentLink1URL: http://www.tdk.com/pdf/general_B11.pdf; ComponentLink1Description: http://www.tdk.com/pdf/general_B11.pdf; .Checked SCH: used
C39 C42 = CL03A105KQ3CSNC: CAP CER 1UF 6.3V X5R 0201; Manufacturer: Samsung; Tolerance: 10%; Supplier 1: Digi-Key; Manufacturer Part Number: CL03A105KQ3CSNC; Stock 1: 1049900; Pricing 1: 10000=0.0226, 20000=0.0215, 30000=0.0204, 50000=0.0187, 100000=0.0154, 250000=0.0141 (USD); Mount: Surface Mount; Case/Package: 0201; Case Code (Metric): 0603; Case Code (Imperial): 0201; Contact Plating: Tin; Min Operating Temperature: -55°C; Max Operating Temperature: 85°C; Capacitance: 1uF; Packaging: Tape and Reel; Voltage Rating: 6.3V; Dielectric: X5R; Series: CL; Construction: Flat; Length: 0.6mm; Width: 0.012inch; Height: 0.3mm; Thickness: 0.013inch; Depth: 0.3mm; Radiation Hardening: No; RoHS Compliant: Yes; ComponentLink1URL: https://datasheet.ciiva.com/18699/cl03a105kq3csnc-18699129.pdf?src-supplier=Digi-Key; ComponentLink1Description: https://datasheet.ciiva.com/18699/cl03a105kq3csnc-18699129.pdf?src-supplier=Digi-Key; ComponentLink2URL: https://datasheet.ciiva.com/26838/getdatasheetpartid-355153-26838086.pdf?src-supplier=Verical; ComponentLink2Description: https://datasheet.ciiva.com/26838/getdatasheetpartid-355153-26838086.pdf?src-supplier=Verical; Supplier Part Number 1: 1276-1323-2-ND
C41 = C1005X5R1C105K: CAP CER 1.0UF 16V X5R 0402; Manufacturer: TDK Corporation; Capacitance: 1.0µF; Value: 1uF; .Checked PCB: used; Tolerance: ±10%; Category: Capacitors; Supplier Part Number: 445-4978-1-ND; Manufacturer Part Number: C1005X5R1C105K; Operating Temperature: -55°C ~ 85°C; Package / Case: 0402 (1005 Metric); Price 1k [$]: 0.02080; .Checked SCH: used; Voltage - Rated: 16V; Supplier: Digikey; Supplier 1: Digi-Key; Supplier Part Number 1: 445-4978-1-ND; RoHS: RoHS Compliant; Stock 1: 341010; Pricing 1: 1=0.24, 10=0.16, 100=0.064, 250=0.046, 500=0.0328, 1000=0.024 (USD); Temperature Coefficient: X5R; Mounting Type: Surface Mount, MLCC; Applications: General Purpose; Ratings: -; Size / Dimension: 0.039" L x 0.020" W (1.00mm x 0.50mm); Height - Seated (Max): -; Thickness (Max): 0.022" (0.55mm); Lead Spacing: -; Features: -; Packaging: Cut Tape (CT); Lead Style: -; ComponentLink1URL: http://www.tdk.co.jp/tefe02/e412_c.pdf; ComponentLink1Description: http://www.tdk.co.jp/tefe02/e412_c.pdf
C43 = C1005X5R1H104K: CAP CER .10UF 50V X5R 10% 0402; Manufacturer: TDK Corporation; Capacitance: 0.1µF; Value: 100nF; .Checked PCB: used; Category: Capacitors; Supplier Part Number: 445-5942-1-ND; Manufacturer Part Number: C1005X5R1H104K; Operating Temperature: -55°C ~ 85°C; Package / Case: 0402 (1005 Metric); Price 1k [$]: 0.02340; .Checked SCH: used; Voltage - Rated: 50V; Supplier: Digikey; Supplier 1: Digi-Key; Supplier Part Number 1: 445-5942-1-ND; RoHS: RoHS Compliant; Stock 1: 106926; Pricing 1: 1=0.27, 10=0.18, 100=0.072, 250=0.05176, 500=0.0369, 1000=0.027 (USD); Tolerance: ±10%; Temperature Coefficient: X5R; Mounting Type: Surface Mount, MLCC; Applications: General Purpose; Ratings: -; Size / Dimension: 0.039" L x 0.020" W (1.00mm x 0.50mm); Height - Seated (Max): -; Thickness (Max): 0.022" (0.55mm); Lead Spacing: -; Features: -; Packaging: Cut Tape (CT); Lead Style: -; ComponentLink1URL: http://www.tdk.co.jp/tefe02/e412_c.pdf; ComponentLink1Description: http://www.tdk.co.jp/tefe02/e412_c.pdf
C135 = C0603X5R1C103K030BA: CAP CER .01UF 16V 10% X5R 0201; Manufacturer: TDK Corporation; Capacitance: 10000pF; .Creator: MM; Supplier 1: Digi-Key; Manufacturer Part Number: C0603X5R1C103K030BA; RoHS: RoHS Compliant; Category: Capacitors; Stock 1: 24793; Pricing 1: 1=0.1, 10=0.043, 100=0.0196, 250=0.01608, 500=0.01374, 1000=0.0105, 5000=0.00875 (USD); Packaging: Cut Tape (CT); Tolerance: ±10%; Voltage - Rated: 16V; Temperature Coefficient: X5R; Mounting Type: Surface Mount, MLCC; Operating Temperature: -55°C ~ 85°C; Applications: General Purpose; Ratings: -; Package / Case: 0201 (0603 Metric); Size / Dimension: 0.024" L x 0.012" W (0.60mm x 0.30mm); Height - Seated (Max): -; Thickness (Max): 0.013" (0.33mm); Lead Spacing: -; Features: -; Lead Style: -; ComponentLink1URL: http://product.tdk.com/en/catalog/datasheets/mlcc_commercial_general_en.pdf; ComponentLink1Description: http://product.tdk.com/en/catalog/datasheets/mlcc_commercial_general_en.pdf; Supplier Part Number 1: 445-16166-1-ND; .Checked PCB: MM; .Checked SCH: MM
IC1 = TPS6521904RHBR: INTEGRATED POWER MANAGEMENT; Manufacturer_Name: Texas Instruments; Manufacturer_Part_Number: TPS92682QRHMRQ1; Datasheet Link: http://www.ti.com/lit/gpn/TPS92682-Q1; Height: 0.9mm; Mouser Part Number: 595-TPS92682QRHMRQ1; Mouser Price/Stock: https://www.mouser.co.uk/ProductDetail/Texas-Instruments/TPS92682QRHMRQ1?qs=RcG8xmE7yp2UHbI0mG8Vdw%3D%3D; Arrow Part Number: TPS92682QRHMRQ1; Arrow Price/Stock: https://www.arrow.com/en/products/tps92682qrhmrq1/texas-instruments; Supplier 1: Digi-Key; Manufacturer: Texas Instruments; Manufacturer Part Number: TPS6521904RHBR; Stock 1: 0; Pricing 1: 3000=1.4508, 6000=1.3962 (USD); Supplier Part Number 1: 296-TPS6521904RHBRTR-ND
IC2 = TPS22965DSGT: Integrated Circuit; Manufacturer_Name: Texas Instruments; Output Current: 6A; Number of Outputs: 1; On-State Resistance: 16mR; Turn-Off Delay Time: 80us; Turn-On Delay Time: 2.2ms; Voltage: 5.5V; Quiescent Current: 50uA; Interface: On/Off; Output Configuration: High Side; Datasheet Link: http://www.ti.com/general/docs/suppproductinfo.tsp?distId=10&gotoUrl=http%3A%2F%2Fwww.ti.com%2Flit%2Fgpn%2Ftps22965; Height: 0.8mm; Manufacturer_Part_Number: TPS22965DSGT; Mouser Part Number: 595-TPS22965DSGT; Mouser Price/Stock: https://www.mouser.co.uk/ProductDetail/Texas-Instruments/TPS22965DSGT?qs=VMlqFFbv3sTWjOIm1M%252B0jg%3D%3D; Arrow Part Number: TPS22965DSGT; Arrow Price/Stock: https://www.arrow.com/en/products/tps22965dsgt/texas-instruments?region=nac; Supplier 1: Farnell; Manufacturer: Texas Instruments; Manufacturer Part Number: TPS22965DSGT; Stock 1: 70; Pricing 1: 100=0.547, 250=0.54, 500=0.531, 1000=0.524, 2500=0.516, 5000=0.508 (GBP); Mount: Surface Mount; Number of Pins: 8; Contact Plating: Gold; Weight: 0.000384oz; Min Operating Temperature: -40°C; Max Operating Temperature: 105°C; Packaging: Tape and Reel; Package Quantity: 250; Current: 6A; Number of Channels: 1; Max Supply Voltage: 5.5V; Series: -; Max Output Current: 6A; Length: 2.1mm; Width: 2.1mm; Radiation Hardening: No; Reach SVHC Compliant: Yes; Lead Free: Lead Free; RoHS Compliant: Yes; ComponentLink1URL: https://datasheet.ciiva.com/28652/1787980-28652428.pdf?src-supplier=Element14; ComponentLink1Description: https://datasheet.ciiva.com/28652/1787980-28652428.pdf?src-supplier=Element14; ComponentLink2URL: https://datasheet.ciiva.com/12073/tps22965-213489-12073929.pdf?src-supplier=Mouser; ComponentLink2Description: https://datasheet.ciiva.com/12073/tps22965-213489-12073929.pdf?src-supplier=Mouser; ComponentLink3URL: https://datasheet.ciiva.com/26909/getdatasheetpartid-636510-26909269.pdf?src-supplier=Verical; ComponentLink3Description: https://datasheet.ciiva.com/26909/getdatasheetpartid-636510-26909269.pdf?src-supplier=Verical; ComponentLink4URL: https://datasheet.ciiva.com/46385/1887483-46385450.pdf?src-supplier=Element14; ComponentLink4Description: https://datasheet.ciiva.com/46385/1887483-46385450.pdf?src-supplier=Element14; ComponentLink5URL: https://datasheet.ciiva.com/6608/tps22965-6608203.pdf?src-supplier=Digi-Key; ComponentLink5Description: https://datasheet.ciiva.com/6608/tps22965-6608203.pdf?src-supplier=Digi-Key; ComponentLink6URL: https://datasheet.ciiva.com/6608/tps22965-6608201.pdf?src-supplier=Digi-Key; ComponentLink6Description: https://datasheet.ciiva.com/6608/tps22965-6608201.pdf?src-supplier=Digi-Key; ComponentLink7URL: https://datasheet.ciiva.com/6608/tps22965-6608205.pdf?src-supplier=Digi-Key; ComponentLink7Description: https://datasheet.ciiva.com/6608/tps22965-6608205.pdf?src-supplier=Digi-Key; Supplier Part Number 1: 3124076RL
IC3 = TLV75518PDBVR: IC REG LINEAR 1.8V 500MA SOT23-5; Manufacturer_Name: Texas Instruments; Output Type: Fixed; Output Configuration: Positive; Number of Regulators: 1; Max Input Voltage: 5.5V; Quiescent Current: 31uA; Power Supply Rejection Ratio (PSRR): 52dB; Max Output Voltage: 3.3V; Dropout Voltage: 400mV; Datasheet Link: http://www.ti.com/lit/gpn/tlv755p; Height: 1.45mm; Manufacturer_Part_Number: TLV75518PDBVR; Mouser Part Number: 595-TLV75518PDBVR; Mouser Price/Stock: https://www.mouser.co.uk/ProductDetail/Texas-Instruments/TLV75518PDBVR?qs=55YtniHzbhCKl5yPgBW9OQ%3D%3D; Arrow Part Number: TLV75518PDBVR; Arrow Price/Stock: https://www.arrow.com/en/products/tlv75518pdbvr/texas-instruments?region=nac; Supplier 1: Digi-Key; Manufacturer: Texas Instruments; Manufacturer Part Number: TLV75518PDBVR; Stock 1: 9000; Pricing 1: 3000=0.1054, 6000=0.0996, 15000=0.0908, 30000=0.0849, 75000=0.0762 (USD); Mount: Surface Mount; Case/Package: SOT-23-5; Min Operating Temperature: -40°C; Max Operating Temperature: 125°C; Min Output Voltage: 1.8V; Output Current: 500mA; Packaging: Cut Tape; ComponentLink1URL: http://www.ti.com/lit/ds/symlink/tlv755p.pdf?src-supplier=Digi-Key; ComponentLink1Description: http://www.ti.com/lit/ds/symlink/tlv755p.pdf?src-supplier=Digi-Key; ComponentLink2URL: http://www.ti.com/general/docs/suppproductinfo.tsp?distId=10&amp;gotoUrl=http%3A%2F%2Fwww.ti.com%2Flit%2Fgpn%2Ftlv755p&src-supplier=Digi-Key; ComponentLink2Description: http://www.ti.com/general/docs/suppproductinfo.tsp?distId=10&amp;gotoUrl=http%3A%2F%2Fwww.ti.com%2Flit%2Fgpn%2Ftlv755p&src-supplier=Digi-Key; Supplier Part Number 1: 296-50410-2-ND
L1 = DFE322520F-R47M=P2: FIXED IND 0.47UH 8.5A; Manufacturer: Murata; Supplier 1: Digi-Key; Manufacturer Part Number: DFE322520F-R47M=P2; Stock 1: 1396; Pricing 1: 1=0.7, 10=0.648, 25=0.548, 50=0.4982, 100=0.4683, 250=0.4185, 500=0.3587, 1000=0.3188 (USD); Supplier Part Number 1: 490-DFE322520F-R47M=P2DKR-ND
L2 L3 = TFM201208BLE-R47MTCF: 470 nH Shielded Thin Film Inductor 4 A 29mOhm Max 0805 (2012 Metric); Manufacturer: TDK; Supplier 1: Digi-Key; Manufacturer Part Number: TFM201208BLE-R47MTCF; Stock 1: 2175; Pricing 1: 1=0.55, 10=0.507, 25=0.4288, 50=0.3898, 100=0.3664, 250=0.3274, 500=0.2807, 1000=0.2495 (USD); Supplier Part Number 1: 445-TFM201208BLE-R47MTCFDKR-ND
R18-R21 R29 R30 = RC0402FR-0710KL: RES 10.0K OHM 1/16W 1% 0402 SMD; Manufacturer: Yageo; Power (Watts): 0.063W, 1/16W; .Checked PCB: used; Temperature Coefficient: ±100ppm/°C; Category: Resistors; Supplier Part Number: 311-10.0KLRCT-ND; Manufacturer Part Number: RC0402FR-0710KL; Package / Case: 0402 (1005 Metric); Price 1k [$]: 0.01421; Resistance (Ohms): 10K; Tolerance: ±1%; Value: 10k; .Checked SCH: used; Supplier: Digikey; Supplier 1: Digi-Key; Supplier Part Number 1: 311-10.0KLRCT-ND; RoHS: RoHS Compliant; Stock 1: 2916495; Pricing 1: 10=0.014, 50=0.0104, 100=0.0079, 250=0.00584, 500=0.00432, 1000=0.00288 (USD); Composition: Thick Film; Features: -; Size / Dimension: 0.039" L x 0.020" W (1.00mm x 0.50mm); Height: 0.016" (0.40mm); Number of Terminations: 2; Packaging: Cut Tape (CT); ComponentLink1URL: http://www.yageo.com/documents/recent/PYu-RC0402_51_RoHS_L_6.pdf; ComponentLink1Description: http://www.yageo.com/documents/recent/PYu-RC0402_51_RoHS_L_6.pdf
R22-R25 R31 = RC0201JR-070RL: RES 0 OHM JUMPER 1/20W 0201; Manufacturer: Yageo; Power Rating: 50mW; Tolerance: 5%; Voltage Rating: 25V; Supplier 1: Digi-Key; Manufacturer Part Number: RC0201JR-070RL; Stock 1: 3344581; Pricing 1: 1=0.1, 10=0.037, 25=0.0268, 50=0.0202, 100=0.015, 250=0.0114, 500=0.0091, 1000=0.0067, 5000=0.0048 (USD); Case/Package: 0201; Contact Plating: Tin,Matte; Case Code (Metric): 0603; Case Code (Imperial): 0201; Weight: 6E-06oz; Size Code: 0201; Min Operating Temperature: -55°C; Max Operating Temperature: 125°C; Resistor Type: Thick Film; Packaging: Tape and Reel; Resistance: 0R; Package Quantity: 1; Series: RC; Number of Terminations: 2; Termination: SMD/SMT; Max Power Dissipation: 50mW; Voltage Rating (DC): 25V; Features: Moisture Resistant; Construction: Rectangular; Resistance Tolerance: 5%; Length: 0.024inch; Width: 0.012inch; Height: 0.01inch; Depth: 0.3mm; Radiation Hardening: No; RoHS Compliant: Yes; Lead Free: Lead Free; Military Standard: Not; ComponentLink1URL: https://datasheet.ciiva.com/7672/1563626-7672248.pdf?src-supplier=Element14; ComponentLink1Description: https://datasheet.ciiva.com/7672/1563626-7672248.pdf?src-supplier=Element14; ComponentLink2URL: https://datasheet.ciiva.com/7672/1563626-7672247.pdf?src-supplier=Element14; ComponentLink2Description: https://datasheet.ciiva.com/7672/1563626-7672247.pdf?src-supplier=Element14; ComponentLink3URL: https://datasheet.ciiva.com/7660/1421516-7660808.pdf?src-supplier=Element14; ComponentLink3Description: https://datasheet.ciiva.com/7660/1421516-7660808.pdf?src-supplier=Element14; ComponentLink4URL: https://datasheet.ciiva.com/46391/1421516-46391340.pdf?src-supplier=Element14; ComponentLink4Description: https://datasheet.ciiva.com/46391/1421516-46391340.pdf?src-supplier=Element14; ComponentLink5URL: https://datasheet.ciiva.com/8896/pyu-rc0201-51-rohs-l-8-8896143.pdf?src-supplier=Avnet; ComponentLink5Description: https://datasheet.ciiva.com/8896/pyu-rc0201-51-rohs-l-8-8896143.pdf?src-supplier=Avnet; Supplier Part Number 1: 311-0.0NDKR-ND
R26-R28 = RC0402JR-070RL: RES 0.0 OHM 1/16W 0402 SMD; Manufacturer: Yageo; Resistance (Ohms): 0.0; Power (Watts): 0.063W, 1/16W; Tolerance: Jumper; .Checked PCB: used; Category: Resistors; Supplier Part Number: 311-0.0JRCT-ND; Manufacturer Part Number: RC0402JR-070RL; Package / Case: 0402 (1005 Metric); Price 1k [$]: 0.01389; Value: 0R; .Checked SCH: used; Supplier: Digikey; Supplier 1: Digi-Key; Supplier Part Number 1: 311-0.0JRCT-ND; RoHS: RoHS Compliant; Stock 1: 1106330; Pricing 1: 10=0.012, 50=0.009, 100=0.0069, 250=0.00512, 500=0.0038, 1000=0.00253 (USD); Composition: Thick Film; Features: -; Temperature Coefficient: -; Size / Dimension: 0.039" L x 0.020" W (1.00mm x 0.50mm); Height: 0.016" (0.40mm); Number of Terminations: 2; Packaging: Cut Tape (CT); ComponentLink1URL: http://www.yageo.com/documents/recent/PYu-RC0402_51_RoHS_L_6.pdf; ComponentLink1Description: http://www.yageo.com/documents/recent/PYu-RC0402_51_RoHS_L_6.pdf
R32 = RC0201FR-0710KL: RES 10K OHM 1/20W 1% 0201 SMD; Manufacturer: Yageo; Power (Watts): 0.05W, 1/20W; Temperature Coefficient: ±200ppm/°C; .Creator: MM; Supplier 1: Digi-Key; Manufacturer Part Number: RC0201FR-0710KL; RoHS: RoHS Compliant; Category: Resistors; Stock 1: 529049; Pricing 1: 1=0.1, 10=0.074, 25=0.054, 100=0.0303, 250=0.02312, 500=0.0185, 1000=0.01361, 2500=0.01182, 5000=0.00976 (USD); Packaging: Cut Tape (CT); Resistance (Ohms): 10k; Tolerance: ±1%; Composition: Thick Film; Features: Moisture Resistant; Package / Case: 0201 (0603 Metric); Supplier Device Package: 0201; Size / Dimension: 0.024" L x 0.012" W (0.60mm x 0.30mm); Height: 0.010" (0.26mm); Number of Terminations: 2; ComponentLink1URL: http://www.yageo.com/documents/recent/PYu-RC0201_51_RoHS_L_8.pdf; ComponentLink1Description: http://www.yageo.com/documents/recent/PYu-RC0201_51_RoHS_L_8.pdf; Supplier Part Number 1: 311-10.0KMCT-ND; .Checked PCB: MM; .Checked SCH: MM
TP3-TP10 = TP_25MILC: Test Point 25mil